# EAGLE schematic brick_i2c_lcd_mini (EAGLE 7.4.0)
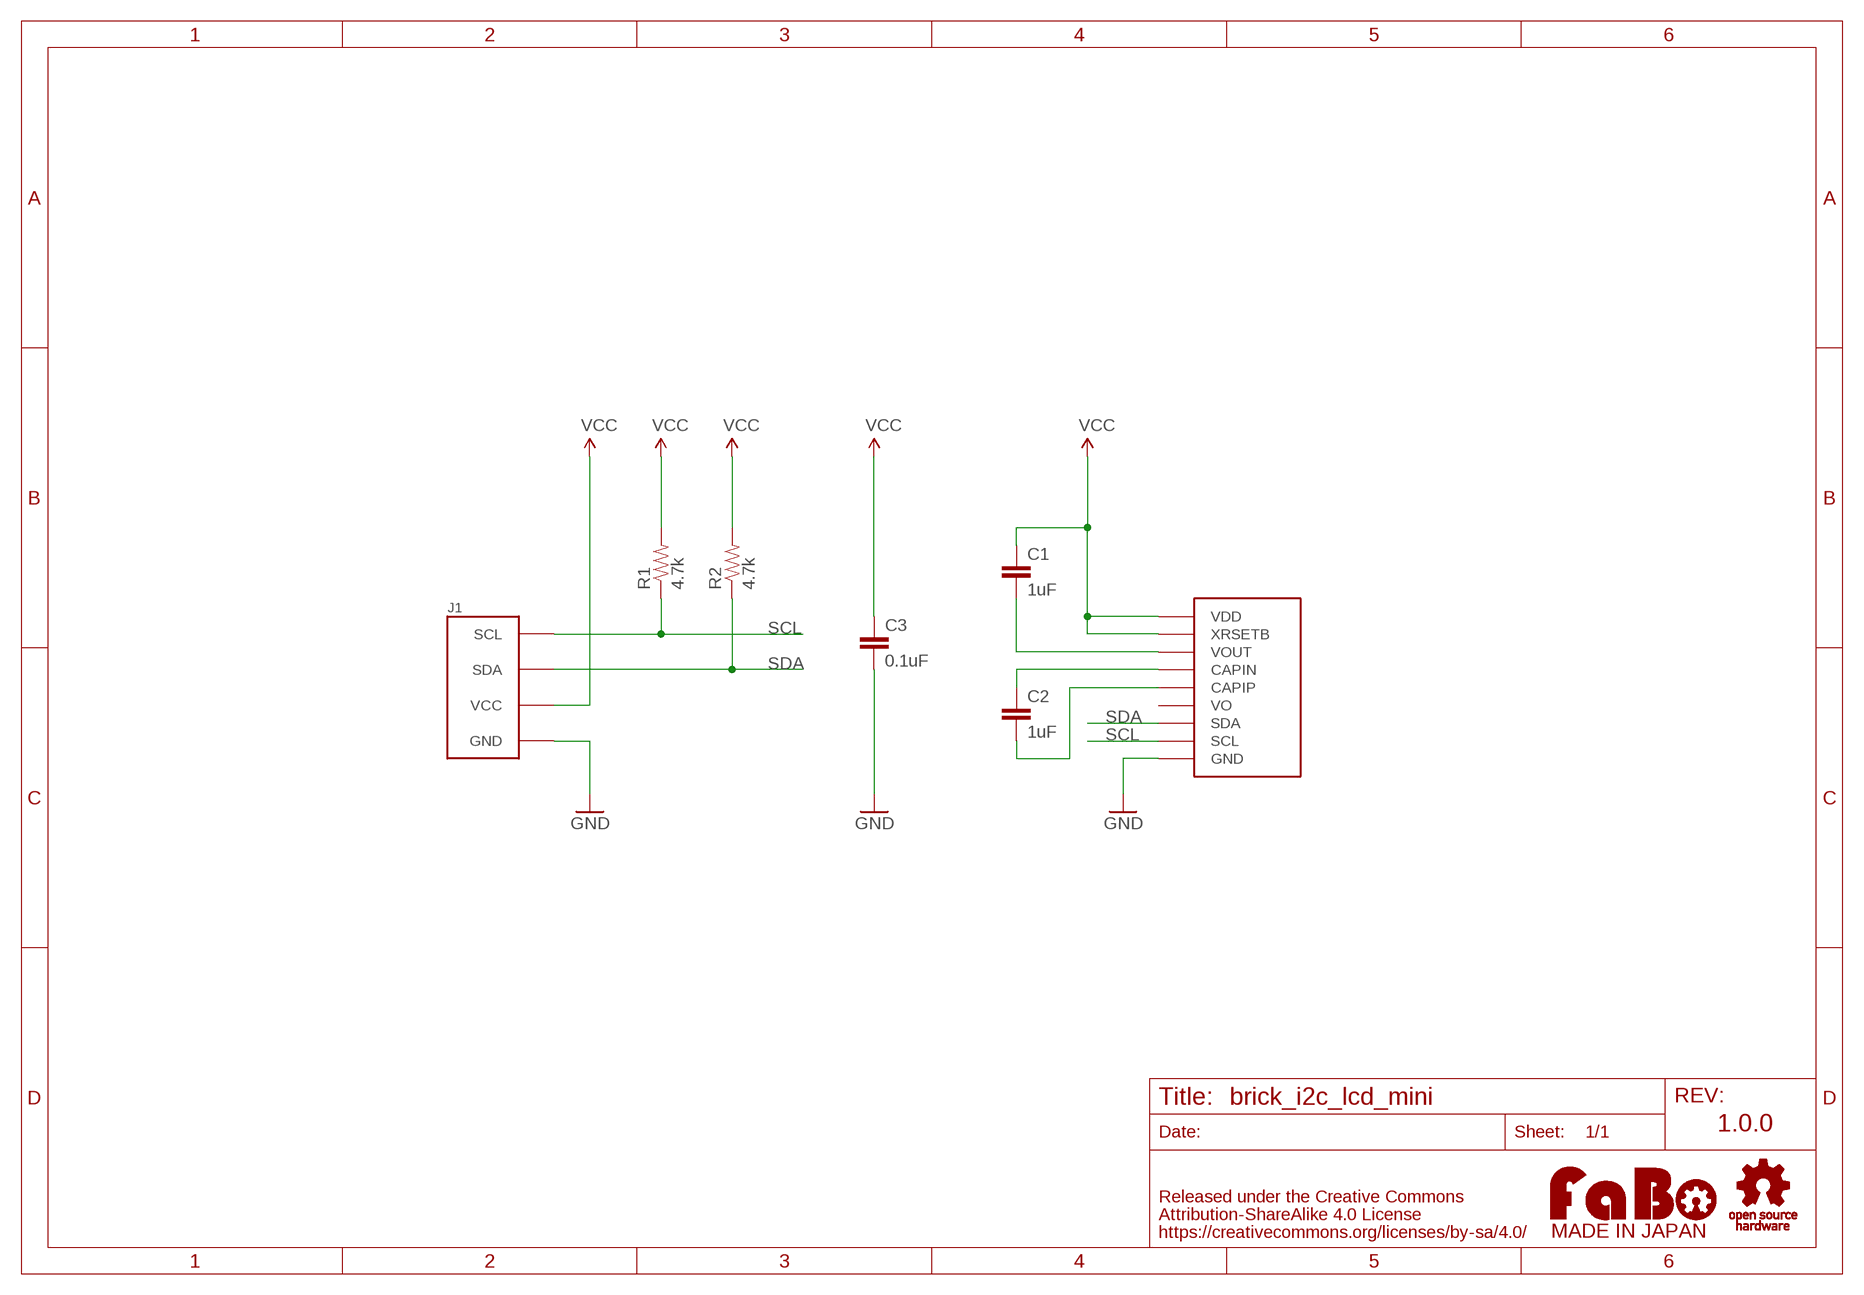
[diagram p0: schematic, sheet 1]

## Parts
C1  1uF  CAP-EIA0603  [EIA0603]
C2  1uF  CAP-EIA0603  [EIA0603]
C3  0.1uF  CAP-EIA0603  [EIA0603]
J1  BRICK_I2C  [BRICK_I2C]
R1  4.7k  RES-EIA0603  [EIA0603]
R2  4.7k  RES-EIA0603  [EIA0603]
U$2  AQM0802A  [AQM0802A]
U$8  LOGO_FABO-M  [LOGO_FABO_M]
U$9  LOGO_OSHW_T-M  [LOGO_OSHW_T_M]

## Nets
GND: C3.2 J1.GND U$2.6(GND)
N$3: C1.2 U$2.2(VOUT)
N$6: C2.1 U$2.3(CAPIN)
N$7: C2.2 U$2.4(CAPIP)
SCL: J1.SCL R1.1 U$2.8(SCL)
SDA: J1.SDA R2.1 U$2.7(SDA)
VCC: C1.1 C3.1 J1.VCC R1.2 R2.2 U$2.5(VDD) U$2.9(XRSETB)
Unconnected: U$2.1(VO)

## Notes on the sheet
- 1.0.0

## Library data of the parts
C1-C3 = GClue:CAP: Capacitor Standard 0603 ceramic capacitor
J1 = GClue:BRICK_I2C: FaBo Brick 4pin(I2C)
R1 R2 = GClue:RES
U$2 = FaBo:AQM0802A
U$8 = FaBo-etc:LOGO_FABO
U$9 = GClue:LOGO_OSHW_T

## Net classes
0 default: width 0.203 mm